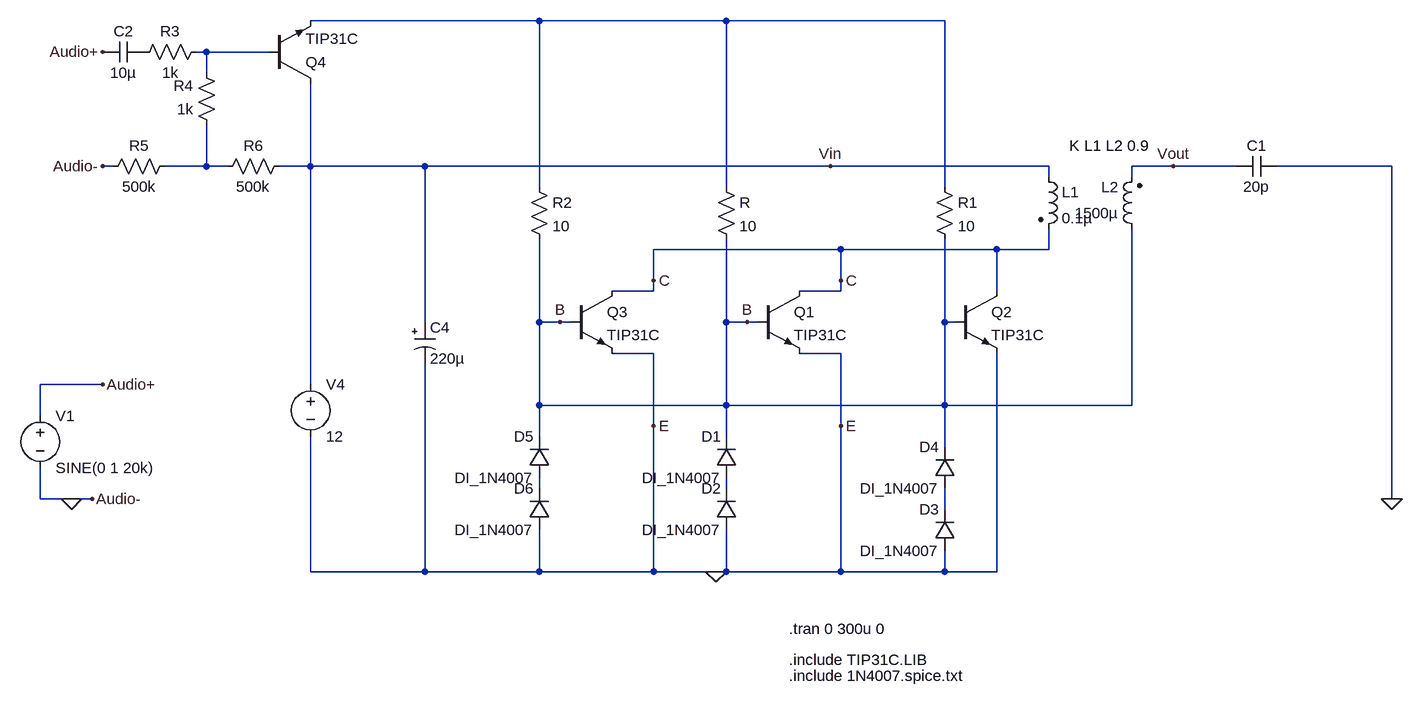
[diagram p0: schematic Circuit.asc]
Circuit.asc, the LTspice schematic file:
Version 4
SHEET 1 2704 680
WIRE 768 -768 416 -768
WIRE 1056 -768 768 -768
WIRE 1392 -768 1056 -768
WIRE 256 -720 240 -720
WIRE 352 -720 256 -720
WIRE 256 -688 256 -720
WIRE 112 -544 96 -544
WIRE 256 -544 256 -608
WIRE 256 -544 192 -544
WIRE 288 -544 256 -544
WIRE 416 -544 416 -672
WIRE 416 -544 368 -544
WIRE 592 -544 416 -544
WIRE 1216 -544 592 -544
WIRE 1552 -544 1216 -544
WIRE 1744 -544 1680 -544
WIRE 1840 -544 1744 -544
WIRE 2080 -544 1904 -544
WIRE 1552 -528 1552 -544
WIRE 1680 -528 1680 -544
WIRE 768 -512 768 -768
WIRE 1056 -512 1056 -768
WIRE 1392 -512 1392 -768
WIRE 1232 -416 944 -416
WIRE 1472 -416 1232 -416
WIRE 1552 -416 1552 -448
WIRE 1552 -416 1472 -416
WIRE 944 -368 944 -416
WIRE 1232 -368 1232 -416
WIRE 944 -352 944 -368
WIRE 944 -352 880 -352
WIRE 1232 -352 1232 -368
WIRE 1232 -352 1168 -352
WIRE 1472 -352 1472 -416
WIRE 592 -304 592 -544
WIRE 768 -304 768 -432
WIRE 800 -304 768 -304
WIRE 816 -304 800 -304
WIRE 1056 -304 1056 -432
WIRE 1088 -304 1056 -304
WIRE 1104 -304 1088 -304
WIRE 1392 -304 1392 -432
WIRE 1408 -304 1392 -304
WIRE 944 -256 880 -256
WIRE 1232 -256 1168 -256
WIRE 96 -208 0 -208
WIRE 416 -208 416 -544
WIRE 768 -176 768 -304
WIRE 1056 -176 1056 -304
WIRE 1056 -176 768 -176
WIRE 1392 -176 1392 -304
WIRE 1392 -176 1056 -176
WIRE 1680 -176 1680 -448
WIRE 1680 -176 1392 -176
WIRE 0 -160 0 -208
WIRE 944 -144 944 -256
WIRE 1232 -144 1232 -256
WIRE 768 -128 768 -176
WIRE 1056 -128 1056 -176
WIRE 1392 -112 1392 -176
WIRE 768 -48 768 -64
WIRE 1056 -48 1056 -64
WIRE 0 -32 0 -80
WIRE 48 -32 0 -32
WIRE 80 -32 48 -32
WIRE 2080 -32 2080 -544
WIRE 1392 -16 1392 -48
WIRE 416 80 416 -128
WIRE 592 80 592 -240
WIRE 592 80 416 80
WIRE 768 80 768 16
WIRE 768 80 592 80
WIRE 944 80 944 -144
WIRE 944 80 768 80
WIRE 1040 80 944 80
WIRE 1056 80 1056 16
WIRE 1056 80 1040 80
WIRE 1232 80 1232 -144
WIRE 1232 80 1056 80
WIRE 1392 80 1392 48
WIRE 1392 80 1232 80
WIRE 1472 80 1472 -256
WIRE 1472 80 1392 80
FLAG 1040 80 0
FLAG 2080 -32 0
FLAG 1744 -544 Vout
FLAG 1216 -544 Vin
FLAG 1232 -368 C
FLAG 1232 -144 E
FLAG 1088 -304 B
FLAG 944 -368 C
FLAG 944 -144 E
FLAG 800 -304 B
FLAG 96 -208 Audio+
FLAG 80 -32 Audio-
FLAG 48 -32 0
FLAG 96 -720 Audio+
FLAG 96 -544 Audio-
DATAFLAG 592 -480 ""
SYMBOL npn 1104 -352 R0
SYMATTR InstName Q1
SYMATTR Value TIP31C
SYMBOL ind2 1536 -544 R0
SYMATTR InstName L1
SYMATTR Value 0.1µ
SYMBOL ind2 1696 -432 R180
WINDOW 0 36 80 Left 2
WINDOW 3 36 40 Left 2
SYMATTR InstName L2
SYMATTR Value 1500µ
SYMBOL voltage 416 -224 R0
WINDOW 123 0 0 Left 0
WINDOW 39 0 0 Left 0
SYMATTR InstName V4
SYMATTR Value 12
SYMBOL cap 1904 -560 R90
WINDOW 0 0 32 VBottom 2
WINDOW 3 32 32 VTop 2
SYMATTR InstName C1
SYMATTR Value 20p
SYMBOL res 1040 -528 R0
SYMATTR InstName R
SYMATTR Value 10
SYMBOL diode 1072 -64 R180
WINDOW 0 24 64 Left 2
WINDOW 3 24 0 Left 2
SYMATTR InstName D1
SYMATTR Value DI_1N4007
SYMBOL diode 1072 16 R180
WINDOW 0 24 64 Left 2
WINDOW 3 24 0 Left 2
SYMATTR InstName D2
SYMATTR Value DI_1N4007
SYMBOL npn 1408 -352 R0
SYMATTR InstName Q2
SYMATTR Value TIP31C
SYMBOL diode 1408 48 R180
WINDOW 0 24 64 Left 2
WINDOW 3 24 0 Left 2
SYMATTR InstName D3
SYMATTR Value DI_1N4007
SYMBOL diode 1408 -48 R180
WINDOW 0 24 64 Left 2
WINDOW 3 24 0 Left 2
SYMATTR InstName D4
SYMATTR Value DI_1N4007
SYMBOL res 1376 -528 R0
SYMATTR InstName R1
SYMATTR Value 10
SYMBOL npn 816 -352 R0
SYMATTR InstName Q3
SYMATTR Value TIP31C
SYMBOL res 752 -528 R0
SYMATTR InstName R2
SYMATTR Value 10
SYMBOL diode 784 -64 R180
WINDOW 0 24 64 Left 2
WINDOW 3 24 0 Left 2
SYMATTR InstName D5
SYMATTR Value DI_1N4007
SYMBOL diode 784 16 R180
WINDOW 0 24 64 Left 2
WINDOW 3 24 0 Left 2
SYMATTR InstName D6
SYMATTR Value DI_1N4007
SYMBOL voltage 0 -176 R0
WINDOW 123 0 0 Left 0
WINDOW 39 0 0 Left 0
SYMATTR InstName V1
SYMATTR Value SINE(0 1 20k)
SYMBOL npn 352 -672 M180
SYMATTR InstName Q4
SYMATTR Value TIP31C
SYMBOL cap 160 -736 R90
WINDOW 0 0 32 VBottom 2
WINDOW 3 32 32 VTop 2
SYMATTR InstName C2
SYMATTR Value 10µ
SYMBOL res 256 -736 R90
WINDOW 0 0 56 VBottom 2
WINDOW 3 32 56 VTop 2
SYMATTR InstName R3
SYMATTR Value 1k
SYMBOL res 272 -592 R180
WINDOW 0 36 76 Left 2
WINDOW 3 36 40 Left 2
SYMATTR InstName R4
SYMATTR Value 1k
SYMBOL res 96 -528 R270
WINDOW 0 32 56 VTop 2
WINDOW 3 0 56 VBottom 2
SYMATTR InstName R5
SYMATTR Value 500k
SYMBOL res 384 -560 R90
WINDOW 0 0 56 VBottom 2
WINDOW 3 32 56 VTop 2
SYMATTR InstName R6
SYMATTR Value 500k
SYMBOL polcap 576 -304 R0
SYMATTR InstName C4
SYMATTR Value 220µ
TEXT 1152 168 Left 2 !.tran 0 300u 0
TEXT 1584 -576 Left 2 !K L1 L2 0.9
TEXT 1152 240 Left 2 !.include 1N4007.spice.txt
TEXT 1152 216 Left 2 !.include TIP31C.LIB

The netlist it stands for:
* Circuit.asc
Q1 C B 0 0 TIP31C
L1 Vin C 0.1µ
L2 B Vout 1500µ
V4 Vin 0 12
C1 0 Vout 20p
R N001 B 10
D1 N005 B DI_1N4007
D2 0 N005 DI_1N4007
Q2 C B 0 0 TIP31C
D3 0 N006 DI_1N4007
D4 N006 B DI_1N4007
R1 N001 B 10
Q3 C B 0 0 TIP31C
R2 N001 B 10
D5 N004 B DI_1N4007
D6 0 N004 DI_1N4007
V1 Audio+ 0 SINE(0 1 20k)
Q4 Vin N002 N001 0 TIP31C
C2 P001 Audio+ 10µ
R3 N002 P001 1k
R4 N003 N002 1k
R5 0 N003 500k
R6 Vin N003 500k
C4 Vin 0 220µ
.model D D
.lib standard.dio
.model NPN NPN
.model PNP PNP
.lib standard.bjt
.tran 0 300u 0
K L1 L2 0.9
.include 1N4007.spice.txt
.include TIP31C.LIB
.backanno
.end